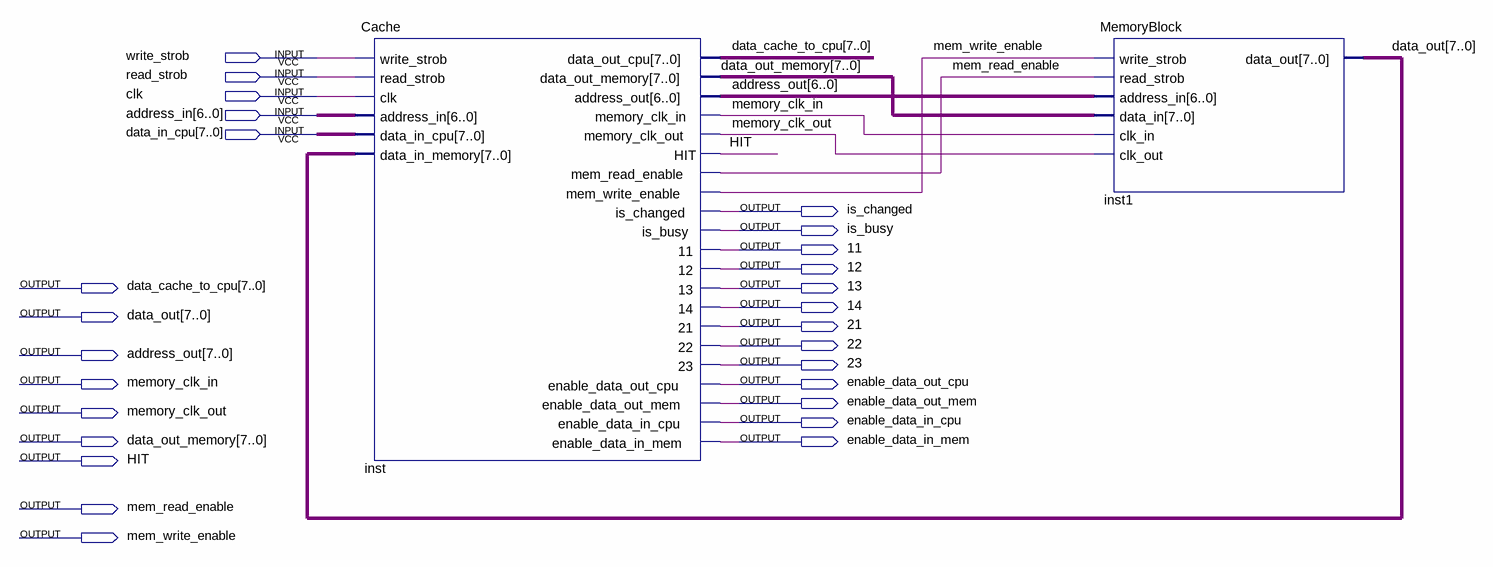
[diagram p0: schematic sheet]
// Quartus schematic All.bdf as structural Verilog: 2 symbols, 27 pins
module All (
  input  write_strob,
  input  read_strob,
  input  clk,
  input  [6:0] address_in,
  input  [7:0] data_in_cpu,
  output is_changed,
  output is_busy,
  output \11 ,
  output \12 ,
  output [7:0] data_cache_to_cpu,
  output \13 ,
  output \14 ,
  output [7:0] data_out,
  output \21 ,
  output \22 ,
  output [7:0] address_out,
  output \23 ,
  output memory_clk_in,
  output enable_data_out_cpu,
  output enable_data_out_mem,
  output memory_clk_out,
  output enable_data_in_cpu,
  output [7:0] data_out_memory,
  output enable_data_in_mem,
  output HIT,
  output mem_read_enable,
  output mem_write_enable
);

  Cache inst (
    .write_strob(write_strob), .read_strob(read_strob), .clk(clk), .address_in(address_in),
    .data_in_cpu(data_in_cpu), .data_in_memory(data_out), .data_out_cpu(data_cache_to_cpu),
    .data_out_memory(data_out_memory), .address_out(address_out[6:0]), .memory_clk_in(memory_clk_in),
    .memory_clk_out(memory_clk_out), .HIT(HIT), .mem_read_enable(mem_read_enable),
    .mem_write_enable(mem_write_enable), .is_changed(is_changed), .is_busy(is_busy), .\11 (\11 ),
    .\12 (\12 ), .\13 (\13 ), .\14 (\14 ), .\21 (\21 ), .\22 (\22 ), .\23 (\23 ),
    .enable_data_out_cpu(enable_data_out_cpu), .enable_data_out_mem(enable_data_out_mem),
    .enable_data_in_cpu(enable_data_in_cpu), .enable_data_in_mem(enable_data_in_mem));
  MemoryBlock inst1 (
    .write_strob(mem_write_enable), .read_strob(mem_read_enable), .address_in(address_out[6:0]),
    .data_in(data_out_memory), .clk_in(memory_clk_in), .clk_out(memory_clk_out), .data_out(data_out));
endmodule
